# EAGLE schematic digitalclock2 (EAGLE 7.5.0)
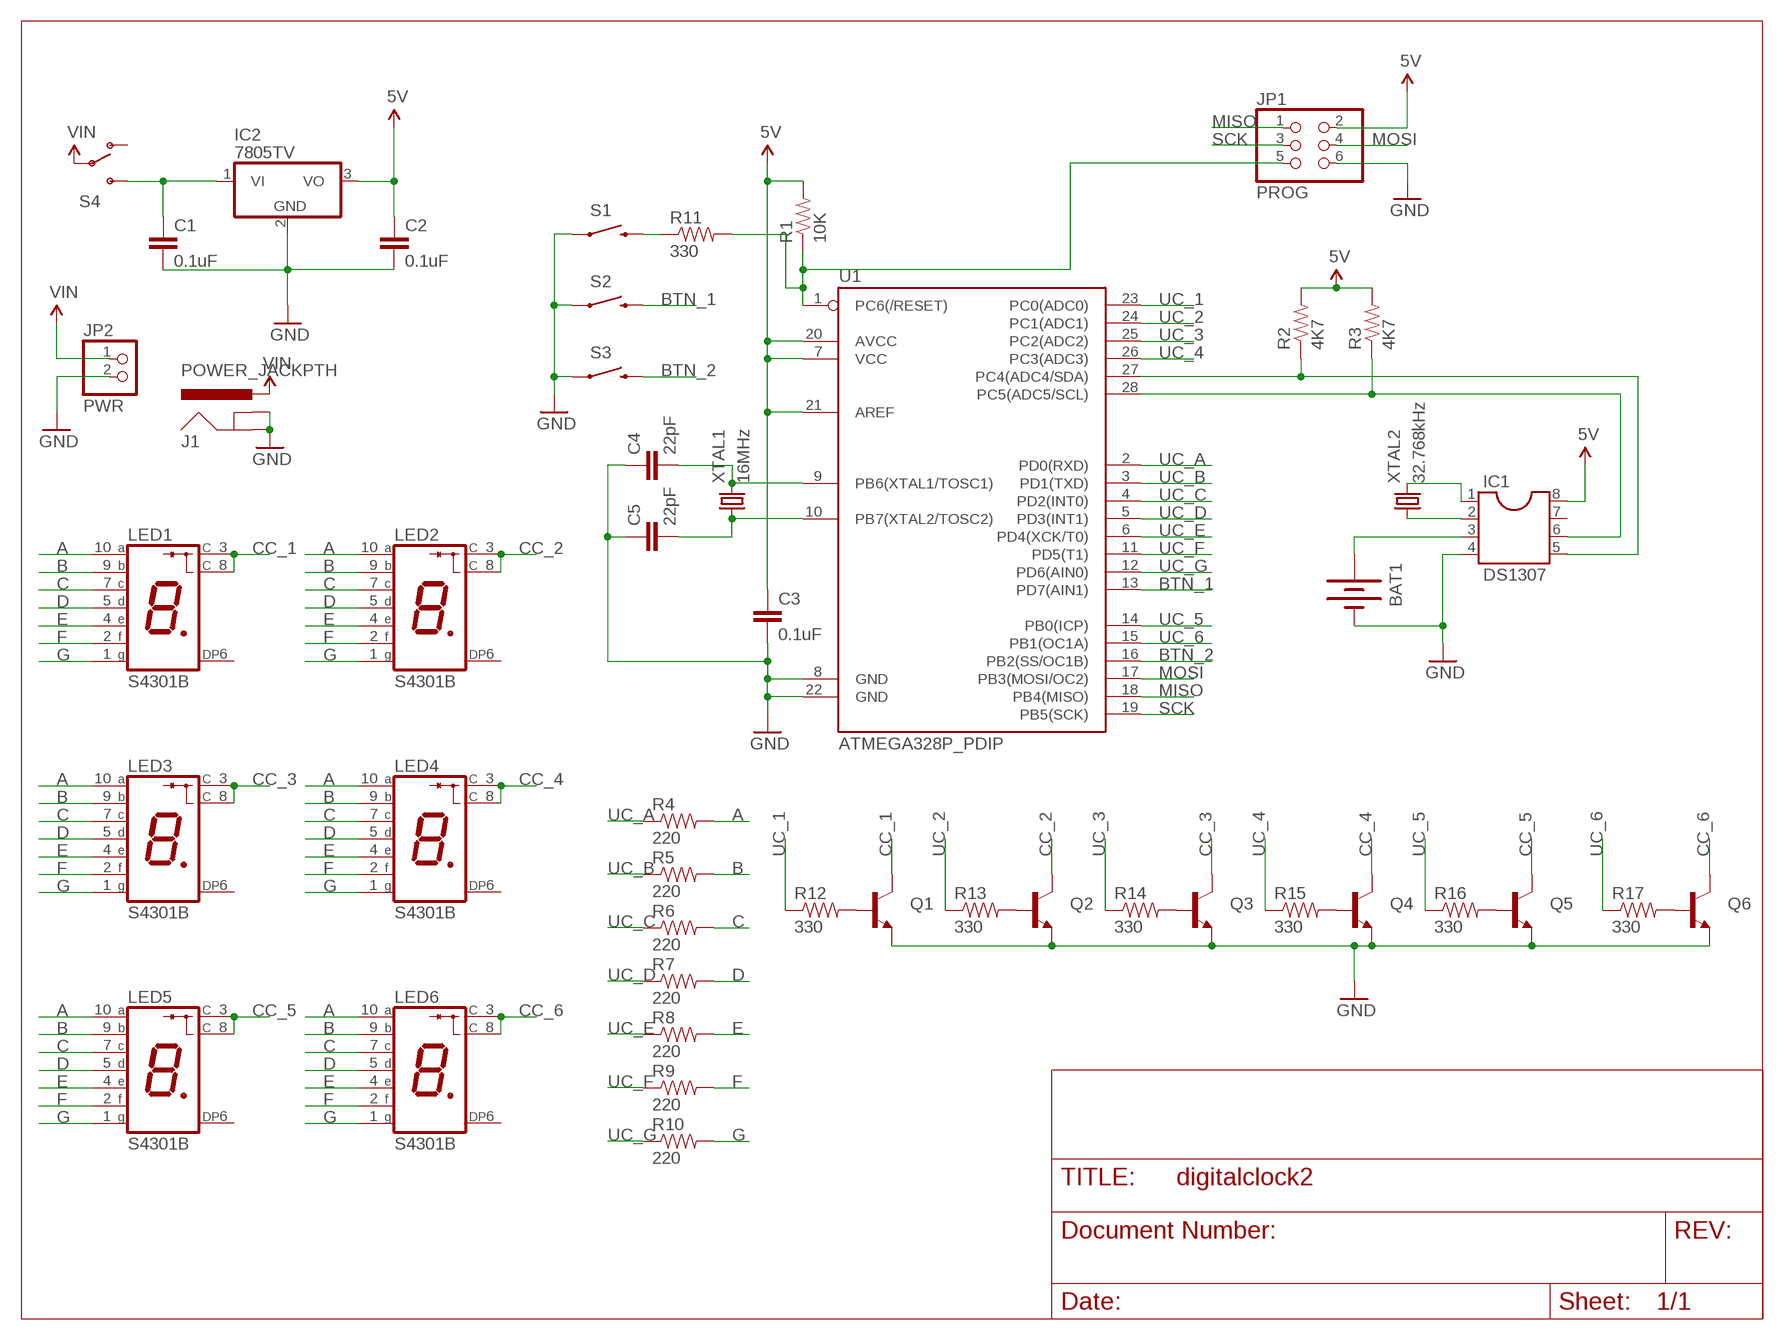
[diagram p0: schematic, sheet 1]

## Parts
BAT1  BATTERY20PTH  [BATTCOM_20MM_PTH]
C1  0.1uF  CAPPTH  [CAP-PTH-SMALL]
C2  0.1uF  CAPPTH  [CAP-PTH-SMALL]
C3  0.1uF  CAPPTH  [CAP-PTH-SMALL]
C4  22pF  CAPPTH  [CAP-PTH-SMALL]
C5  22pF  CAPPTH  [CAP-PTH-SMALL]
IC1  DS1307  DIL8S  [SOCKET-08]
IC2  7805TV  [TO220V]
J1  POWER_JACKPTH  [POWER_JACK_PTH]
JP1  PROG  PINHD-2X3  [2X03]
JP2  PWR  PINHD-1X2  [1X02]
LED1  S4301B  [S4301B]
LED2  S4301B  [S4301B]
LED3  S4301B  [S4301B]
LED4  S4301B  [S4301B]
LED5  S4301B  [S4301B]
LED6  S4301B  [S4301B]
Q1  TRANSISTOR_NPNTO-92-AMMO  [TO-92-AMMO]
Q2  TRANSISTOR_NPNTO-92-AMMO  [TO-92-AMMO]
Q3  TRANSISTOR_NPNTO-92-AMMO  [TO-92-AMMO]
Q4  TRANSISTOR_NPNTO-92-AMMO  [TO-92-AMMO]
Q5  TRANSISTOR_NPNTO-92-AMMO  [TO-92-AMMO]
Q6  TRANSISTOR_NPNTO-92-AMMO  [TO-92-AMMO]
R1  10K  RESISTORAXIAL-0.3  [AXIAL-0.3]
R2  4K7  RESISTORAXIAL-0.3  [AXIAL-0.3]
R3  4K7  RESISTORAXIAL-0.3  [AXIAL-0.3]
R4  220  RESISTORAXIAL-0.3  [AXIAL-0.3]
R5  220  RESISTORAXIAL-0.3  [AXIAL-0.3]
R6  220  RESISTORAXIAL-0.3  [AXIAL-0.3]
R7  220  RESISTORAXIAL-0.3  [AXIAL-0.3]
R8  220  RESISTORAXIAL-0.3  [AXIAL-0.3]
R9  220  RESISTORAXIAL-0.3  [AXIAL-0.3]
R10  220  RESISTORAXIAL-0.3  [AXIAL-0.3]
R11  330  RESISTORAXIAL-0.3  [AXIAL-0.3]
R12  330  RESISTORAXIAL-0.3  [AXIAL-0.3]
R13  330  RESISTORAXIAL-0.3  [AXIAL-0.3]
R14  330  RESISTORAXIAL-0.3  [AXIAL-0.3]
R15  330  RESISTORAXIAL-0.3  [AXIAL-0.3]
R16  330  RESISTORAXIAL-0.3  [AXIAL-0.3]
R17  330  RESISTORAXIAL-0.3  [AXIAL-0.3]
S1  SWITCH-MOMENTARY-2PTH  [TACTILE-PTH]
S2  SWITCH-MOMENTARY-2PTH  [TACTILE-PTH]
S3  SWITCH-MOMENTARY-2PTH  [TACTILE-PTH]
S4  SWITCH-SPDTPTH  [SWITCH-SPDT]
U1  ATMEGA328P_PDIP  [DIL28-3]
XTAL1  16MHz  CRYSTALHC49S  [HC49/S]
XTAL2  32.768kHz  CRYSTALTC26V  [TC26V]

## Nets
5V: C2.1 C3.1 IC1.8 IC2.3(VO) JP1.2 R1.P$2 R2.P$2 R3.P$2 U1.7(VCC) U1.20(AVCC) U1.21(AREF)
A: LED1.10(A) LED2.10(A) LED3.10(A) LED4.10(A) LED5.10(A) LED6.10(A) R4.P$2
B: LED1.9(B) LED2.9(B) LED3.9(B) LED4.9(B) LED5.9(B) LED6.9(B) R5.P$2
BTN_1: S2.3 U1.13(PD7(AIN1))
BTN_2: S3.3 U1.16(PB2(SS/OC1B))
C: LED1.7(C) LED2.7(C) LED3.7(C) LED4.7(C) LED5.7(C) LED6.7(C) R6.P$2
CC_1: LED1.3(C) LED1.8(C) Q1.3(C)
CC_2: LED2.3(C) LED2.8(C) Q2.3(C)
CC_3: LED3.3(C) LED3.8(C) Q3.3(C)
CC_4: LED4.3(C) LED4.8(C) Q4.3(C)
CC_5: LED5.3(C) LED5.8(C) Q5.3(C)
CC_6: LED6.3(C) LED6.8(C) Q6.3(C)
D: LED1.5(D) LED2.5(D) LED3.5(D) LED4.5(D) LED5.5(D) LED6.5(D) R7.P$2
E: LED1.4(E) LED2.4(E) LED3.4(E) LED4.4(E) LED5.4(E) LED6.4(E) R8.P$2
F: LED1.2(F) LED2.2(F) LED3.2(F) LED4.2(F) LED5.2(F) LED6.2(F) R9.P$2
G: LED1.1(G) LED2.1(G) LED3.1(G) LED4.1(G) LED5.1(G) LED6.1(G) R10.P$2
GND: BAT1.2(-) C1.2 C2.2 C3.2 C4.1 C5.1 IC1.4 IC2.2(GND) J1.GND J1.GNDBREAK JP1.6 JP2.2 Q1.1(E) Q2.1(E) Q3.1(E) Q4.1(E) Q5.1(E) Q6.1(E) S1.1 S2.1 S3.1 U1.8(GND) U1.22(GND)
MISO: JP1.1 U1.18(PB4(MISO))
MOSI: JP1.4 U1.17(PB3(MOSI/OC2))
N$1: C4.2 U1.9(PB6(XTAL1/TOSC1)) XTAL1.2
N$2: C5.2 U1.10(PB7(XTAL2/TOSC2)) XTAL1.1
N$3: BAT1.1(+) IC1.3
N$4: R11.P$1 S1.3
N$5: C1.1 IC2.1(VI) S4.3(S)
N$6: IC1.2 XTAL2.1
N$7: IC1.1 XTAL2.2
N$8: IC1.6 R3.P$1 U1.28(PC5(ADC5/SCL))
N$9: IC1.5 R2.P$1 U1.27(PC4(ADC4/SDA))
N$11: JP1.5 R1.P$1 R11.P$2 U1.1(PC6(/RESET))
N$12: Q1.2(B) R12.P$2
N$13: Q2.2(B) R13.P$2
N$14: Q3.2(B) R14.P$2
N$15: Q4.2(B) R15.P$2
N$16: Q5.2(B) R16.P$2
N$17: Q6.2(B) R17.P$2
SCK: JP1.3 U1.19(PB5(SCK))
UC_1: R12.P$1 U1.23(PC0(ADC0))
UC_2: R13.P$1 U1.24(PC1(ADC1))
UC_3: R14.P$1 U1.25(PC2(ADC2))
UC_4: R15.P$1 U1.26(PC3(ADC3))
UC_5: R16.P$1 U1.14(PB0(ICP))
UC_6: R17.P$1 U1.15(PB1(OC1A))
UC_A: R4.P$1 U1.2(PD0(RXD))
UC_B: R5.P$1 U1.3(PD1(TXD))
UC_C: R6.P$1 U1.4(PD2(INT0))
UC_D: R7.P$1 U1.5(PD3(INT1))
UC_E: R8.P$1 U1.6(PD4(XCK/T0))
UC_F: R9.P$1 U1.11(PD5(T1))
UC_G: R10.P$1 U1.12(PD6(AIN0))
VIN: J1.PWR JP2.1 S4.2(P)
Unconnected: IC1.7 LED1.6(DP) LED2.6(DP) LED3.6(DP) LED4.6(DP) LED5.6(DP) LED6.6(DP) S4.1(O)

## Library data of the parts
BAT1 = SparkFun-Electromechanical:BATTERY: Battery Holders Various common sizes : AA, AAA, 18650 (PRT-12895), 20mm coin cell and 12mm coin cell. 20MM_4LEGS, BATT-10373
C1-C5 = SparkFun-Capacitors:CAP: Capacitor Standard 0603 ceramic capacitor, and 0.1" leaded capacitor.
IC1 = ic-package:DIL8: Dual In Line / Socket
IC2 = linear:78*: Positive VOLTAGE REGULATOR Source: http://cache.national.com/ds/LM/LM78L05.pdf http://www.fairchildsemi.com/ds/LM/LM7805.pdf
J1 = SparkFun-Connectors:POWER_JACK: Power Jack This is the standard 5.5mm barrel jack for power. The PTH is the most common, proven, reliable, footprint. The Slot footprint only works if the mill layer is transmitted to the PCB fab house so be warned. Mating wall wart : TOL-00298 (and others); PROD_ID: CONN-08197
JP1 = pinhead:PINHD-2X3: PIN HEADER
JP2 = pinhead:PINHD-1X2: PIN HEADER
LED1-LED6 = led-7-segment:S4301B: Single Digit Seven-Segment Display (cathode common) Source: LITEON .. S4301B.pdf; OC_FARNELL: unknown; OC_NEWARK: unknown
Q1-Q6 = SparkFun-DiscreteSemi:TRANSISTOR_NPN: Generic NPN BJT MMBT2222A - TRANS-08049 (SOT-23, 1A 40V) MPSA42 - TRANS-09116 (SOT-23, 500mA 300V) MMBT5088LT1G - TRANS-11160 (SOT-23, 50 mA 30V) BC547 - COM-08928 <http://www.sparkfun.com/products/8928> (TO-92 45V 100mA) (1.Collector 2.Base 3.Emitter) 2N3904 - COM-00521 <http://www.sparkfun.com/products/521> (TO-92 40V 200mA) (1.Emitter 2.Base 3.Collector) P2N2222A - COM-12852 <http://www.sparkfun.com/products/12852> (TO-92 40V 600mA) (1.Collector 2.Base 3.Emitter)
R1-R17 = SparkFun-Resistors:RESISTOR: Resistor Basic schematic elements and footprints for 0603, 1206, and PTH resistors.
S1-S3 = SparkFun-Electromechanical:SWITCH-MOMENTARY-2: Various NO switches- pushbuttons, reed, etc; PROD_ID: SWCH-08441
S4 = SparkFun-Electromechanical:SWITCH-SPDT: SPDT Switch Simple slide switch, Spark Fun Electronics SKU : COM-00102 DPDT SMT slide switch, AYZ0202, SWCH-08179; PROD_ID: SWCH-08261
U1 = SparkFun-DigitalIC:ATMEGA328P_PDIP: uC used in the Arduino 32kb flash, 1k EEPROM, 2k SRAM This is the through-hole version of this chip.
XTAL1 = crystal:CRYSTAL: CRYSTAL; OC_FARNELL: 1667008; OC_NEWARK: unknown
XTAL2 = crystal:CRYSTAL: CRYSTAL; OC_FARNELL: unknown; OC_NEWARK: unknown